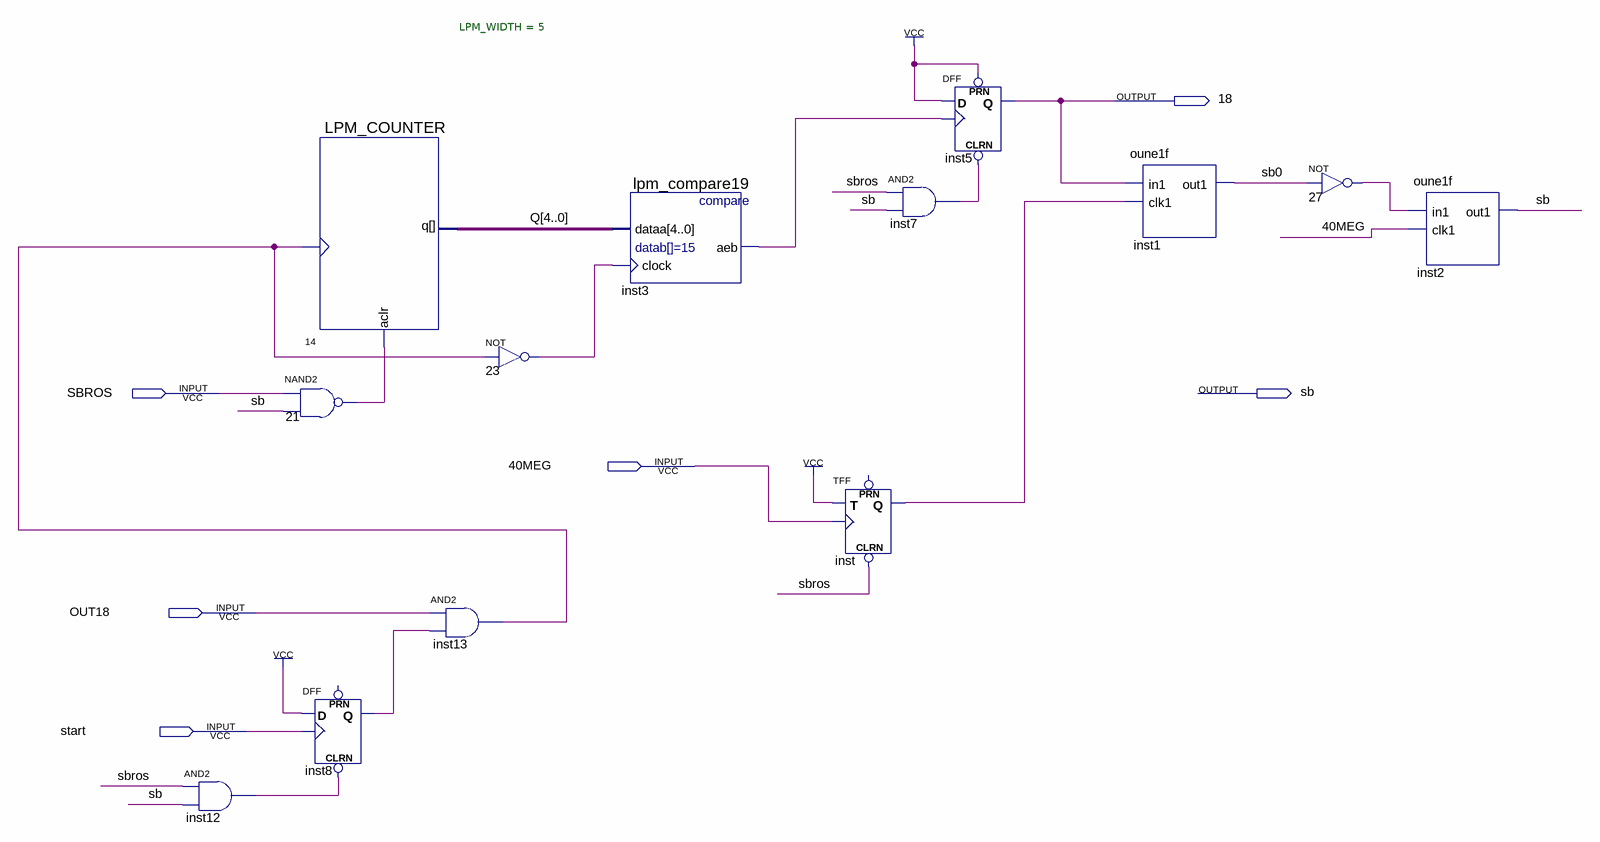
[diagram p0: schematic sheet]
// Quartus schematic count18_out18.bdf as structural Verilog: 13 symbols, 6 pins
module count18_out18 (
  input  SBROS,
  input  \40MEG ,
  input  OUT18,
  input  start,
  output \18 ,
  output sb
);

  wire inst3_aeb, inst7_out, inst8_q, inst12_out, inst13_out, inst_q, n21_out, n23_out, n27_out, sb0;
  wire [4:0] Q;

  and inst12 (inst12_out, SBROS, sb);
  LPM_COUNTER #(.LPM_WIDTH(5)) u_14 (.clock(inst13_out), .aclr(n21_out), .q(Q));
  nand u_21 (n21_out, SBROS, sb);
  DFF inst8 (.CLRN(inst12_out), .CLK(start), .D(1'b1), .Q(inst8_q));  // open: PRN
  and inst13 (inst13_out, OUT18, inst8_q);
  not u_23 (n23_out, inst13_out);
  lpm_compare19 inst3 (.dataa(Q), .clock(n23_out), .aeb(inst3_aeb));
  TFF inst (.CLRN(SBROS), .T(1'b1), .CLK(\40MEG ), .Q(inst_q));  // open: PRN
  and inst7 (inst7_out, SBROS, sb);
  DFF inst5 (.CLRN(inst7_out), .CLK(inst3_aeb), .D(1'b1), .PRN(1'b1), .Q(\18 ));
  oune1f inst1 (.in1(\18 ), .clk1(inst_q), .out1(sb0));
  not u_27 (n27_out, sb0);
  oune1f inst2 (.in1(n27_out), .clk1(\40MEG ), .out1(sb));
endmodule
